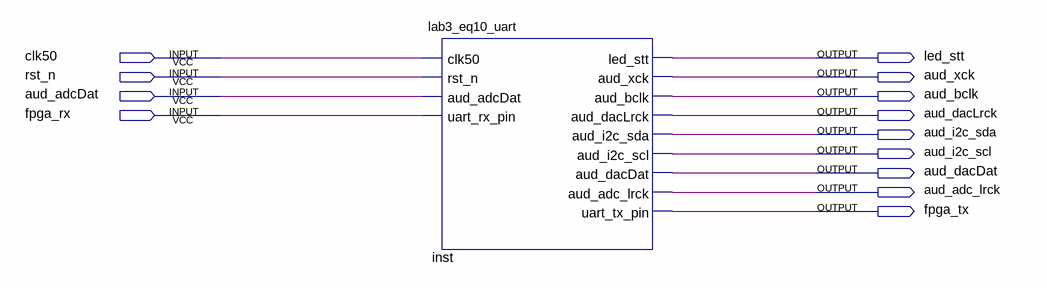
[diagram p0: schematic sheet]
// Quartus schematic lab3.bdf as structural Verilog: 1 symbols, 13 pins
module lab3 (
  input  clk50,
  input  rst_n,
  input  aud_adcDat,
  input  fpga_rx,
  output led_stt,
  output aud_xck,
  output aud_bclk,
  output aud_dacLrck,
  output aud_i2c_sda,
  output aud_i2c_scl,
  output aud_dacDat,
  output aud_adc_lrck,
  output fpga_tx
);

  lab3_eq10_uart inst (
    .clk50(clk50), .rst_n(rst_n), .aud_adcDat(aud_adcDat), .uart_rx_pin(fpga_rx), .led_stt(led_stt),
    .aud_xck(aud_xck), .aud_bclk(aud_bclk), .aud_dacLrck(aud_dacLrck), .aud_i2c_sda(aud_i2c_sda),
    .aud_i2c_scl(aud_i2c_scl), .aud_dacDat(aud_dacDat), .aud_adc_lrck(aud_adc_lrck), .uart_tx_pin(fpga_tx));
endmodule
